# Altium schematic sheet ETH_ICD_CCU_HAS.SchDoc: CCU - Ethernet/USB/Reset
size B; DrawnBy: M. Seago; Organization: Gravitas; Address1: Sponsored By:; Address2: Alan Morgan; Address3: Technical Advisor:; Address4: Dr. Joseph Morgan; Revision: 1A; SheetNumber: 5; SheetTotal: 9
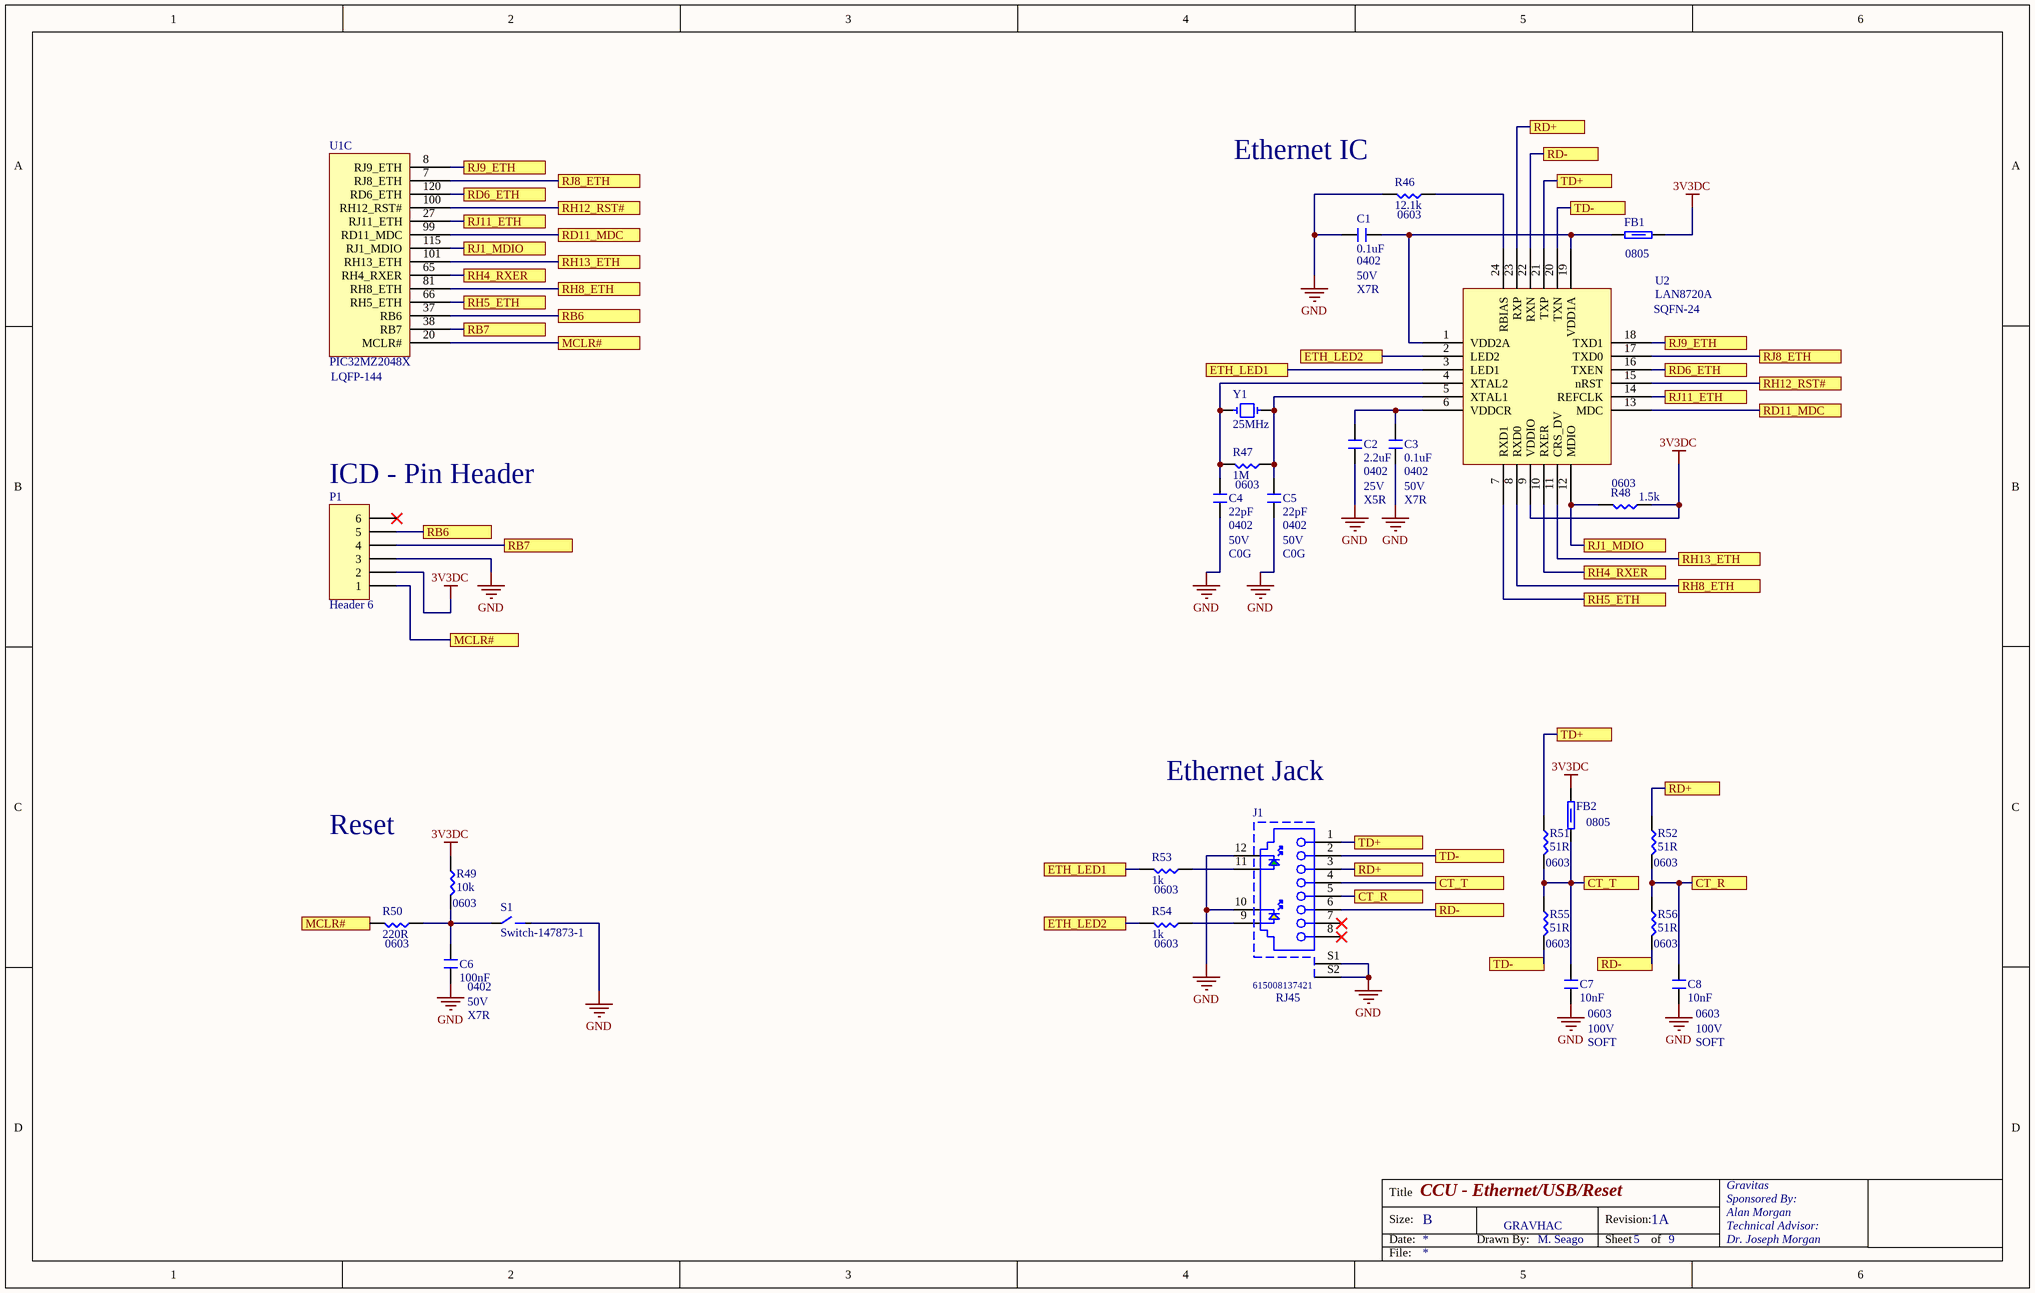
[diagram p0: ETH_ICD_CCU_HAS.SchDoc]

## Parts
C1  0.1uF  [NonPolar-0402]
C2  2.2uF  [NonPolar-0402]
C3  0.1uF  [NonPolar-0402]
C4  22pF  [NonPolar-0402]
C5  22pF  [NonPolar-0402]
C6  100nF  [NonPolar-0402]
C7  10nF  [NonPolar-0603]
C8  10nF  [NonPolar-0603]
FB1  Ferrite - 0805  [NonPolar-0805]  (value not drawn)
FB2  Ferrite - 0805  [NonPolar-0805]  (value not drawn)
J1  615008137421  [615008137421]
P1  Header 6  [HDR1X6]
R46  12.1k  [NonPolar-0603]
R47  1M  [NonPolar-0603]
R48  1.5k  [NonPolar-0603]
R49  10k  [NonPolar-0603]
R50  220R  [NonPolar-0603]
R51  51R  [NonPolar-0603]
R52  51R  [NonPolar-0603]
R53  1k  [NonPolar-0603]
R54  1k  [NonPolar-0603]
R55  51R  [NonPolar-0603]
R56  51R  [NonPolar-0603]
S1  Switch-147873-1  [Switch - 147873-1]
U1  PIC32MZ2048X  [BIG_PIC32MZ]  (part C of 7)
U2  LAN8720A  [LAN8720A]
Y1  25MHz  [7A-25.000MAAJ-T]

## Ports
CT_R, CT_T, ETH_LED1, ETH_LED2, MCLR#, RB6, RB7, RD6_ETH, RD11_MDC, RD+, RD-, RH4_RXER, RH5_ETH, RH8_ETH, RH12_RST#, RH13_ETH, RJ1_MDIO, RJ8_ETH, RJ9_ETH, RJ11_ETH, TD+, TD-

## Nets
3V3DC: FB1.2 FB2.2 P1.2 R48.2 R49.2 U2.9(VDDIO)
GND: C1.1 C2.1 C3.1 C4.1 C5.1 C6.1 C7.1 C8.1 J1.10 J1.12 J1.S1 J1.S2 P1.3 R46.1 S1.2
CT_R: C8.2 J1.5 R52.1 R56.2 ; port CT_R
CT_T: C7.2 FB2.1 J1.4 R51.1 R55.2 ; port CT_T
ETH_LED1: R53.1 U2.3(LED1) ; port ETH_LED1
ETH_LED2: R54.1 U2.2(LED2) ; port ETH_LED2
MCLR#: P1.1 R50.1 U1.20(MCLR#) ; port MCLR#
RB6: P1.5 U1.37(RB6) ; port RB6
RB7: P1.4 U1.38(RB7) ; port RB7
RD6_ETH: U1.120(RD6_ETH) U2.16(TXEN) ; port RD6_ETH
RD11_MDC: U1.99(RD11_MDC) U2.13(MDC) ; port RD11_MDC
RD+: J1.3 R52.2 U2.23(RXP) ; port RD+
RD-: J1.6 R56.1 U2.22(RXN) ; port RD-
RH4_RXER: U1.65(RH4_RXER) U2.10(RXER) ; port RH4_RXER
RH5_ETH: U1.66(RH5_ETH) U2.7(RXD1) ; port RH5_ETH
RH8_ETH: U1.81(RH8_ETH) U2.8(RXD0) ; port RH8_ETH
RH12_RST#: U1.100(RH12_RST#) U2.15(nRST) ; port RH12_RST#
RH13_ETH: U1.101(RH13_ETH) U2.11(CRS_DV) ; port RH13_ETH
RJ1_MDIO: R48.1 U1.115(RJ1_MDIO) U2.12(MDIO) ; port RJ1_MDIO
RJ8_ETH: U1.7(RJ8_ETH) U2.17(TXD0) ; port RJ8_ETH
RJ9_ETH: U1.8(RJ9_ETH) U2.18(TXD1) ; port RJ9_ETH
RJ11_ETH: U1.27(RJ11_ETH) U2.14(REFCLK) ; port RJ11_ETH
TD+: J1.1 R51.2 U2.21(TXP) ; port TD+
TD-: J1.2 R55.1 U2.20(TXN) ; port TD-
NetC1_2: C1.2 FB1.1 U2.1(VDD2A) U2.19(VDD1A)
NetC2_2: C2.2 C3.2 U2.6(VDDCR)
NetC4_2: C4.2 R47.1 U2.4(XTAL2) Y1.1
NetC5_2: C5.2 R47.2 U2.5(XTAL1) Y1.2
NetC6_2: C6.2 R49.1 R50.2 S1.1
NetJ1_9: J1.9 R54.2
NetJ1_11: J1.11 R53.2
NetR46_2: R46.2 U2.24(RBIAS)

Not connected (* = marked no-connect by the designer): J1 7* 8*; P1 6*

## Notes on the sheet
- (near R46) Ethernet IC
- (near R46) 0603
- (near C1) 0402
- (near C1) 50V
- (near C1) X7R
- (near FB1) 0805
- (near U2) SQFN-24
- (near U1) LQFP-144
- (near P1) ICD - Pin Header
- 0603
- 0402
- 25V
- X5R
- (near C3) 0402
- 50V
- X7R
- C0G
- (near C5) 0402
- (near C5) 50V
- (near C5) C0G
- Reset
- Ethernet Jack
- (near FB2) 0805
- (near R49) 0603
- (near R51) 0603
- (near R52) 0603
- (near R50) 0603
- (near R54) 0603
- (near R55) 0603
- (near R56) 0603
- (near C6) 0402
- (near C6) 50V
- (near C6) X7R
- (near J1) RJ45
- (near C7) 0603
- (near C7) 100V
- (near C7) SOFT
- (near C8) 0603
- (near C8) 100V
- (near C8) SOFT
- GRAVHAC
- Title
- Size:
- Date:
- B
- Drawn By:
- Revision:
- Sheet
- of
- File:

## Library data of the parts
C1-C6 = Cap - 0402
C7 C8 = Cap - 0603
J1 = CMP-1502-01697-1: Modular Jack WR-MJ, Tab Up, Shielded, with LED and EMI Panel Finger, Horizontal Entry, THT, 8P8C; Manufacturer: Wurth Elektronik; Compliance: Leadfree/RoHS; Withstanding Voltage: 1000VAC; Port: 1x1; Contact Resistance: 20mOhm; Rated Current: 1.5A; Working Voltage: 120VAC; Manufacturer URL: http://www.we-online.de; Mounting Technology: THT; Entrance: Horizontal; Datasheet URL: https://katalog.we-online.de/em/datasheet/615008137421.pdf; Packaging: Tray; Package Reference: 615008137421; Publisher: WurthElektronik; Operating Temperature: -40to85degC; Part Number: 615008137421; Pin Number: 8P8C
P1 = Header 6: Header, 6-Pin; LatestRevisionDate: 17-Jul-2002; LatestRevisionNote: Re-released for DXP Platform.; Publisher: Altium Limited
R46-R56 = Res - 0603
Y1 = 25MHz -7A-25.000MAAJ-T